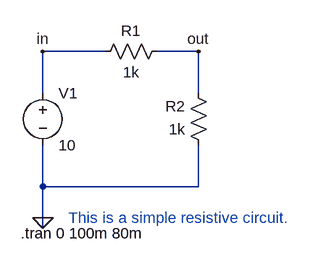
[diagram p0: schematic exercise1.asc]
exercise1.asc, the LTspice schematic file:
Version 4
SHEET 1 1256 680
WIRE 352 -304 256 -304
WIRE 496 -304 432 -304
WIRE 256 -240 256 -304
WIRE 496 -240 496 -304
WIRE 256 -96 256 -160
WIRE 496 -96 496 -160
WIRE 496 -96 256 -96
WIRE 256 -48 256 -96
WIRE 256 -32 256 -48
FLAG 496 -304 out
FLAG 256 -304 in
FLAG 256 -48 0
SYMBOL res 448 -320 R90
WINDOW 0 0 56 VBottom 2
WINDOW 3 32 56 VTop 2
SYMATTR InstName R1
SYMATTR Value 1k
SYMBOL res 512 -144 R180
WINDOW 0 36 76 Left 2
WINDOW 3 36 40 Left 2
SYMATTR InstName R2
SYMATTR Value 1k
SYMBOL voltage 256 -256 R0
WINDOW 123 0 0 Left 0
WINDOW 39 0 0 Left 0
SYMATTR InstName V1
SYMATTR Value 10
TEXT 296 -48 Left 2 ;This is a simple resistive circuit.
TEXT 222 -24 Left 2 !.tran 0 100m 80m

The netlist it stands for:
* exercise1.asc
R1 out in 1k
R2 0 out 1k
V1 in 0 10
* This is a simple resistive circuit.
.tran 0 100m 80m
.backanno
.end